# Altium project bidirectionalLevelShifter.PrjPcb
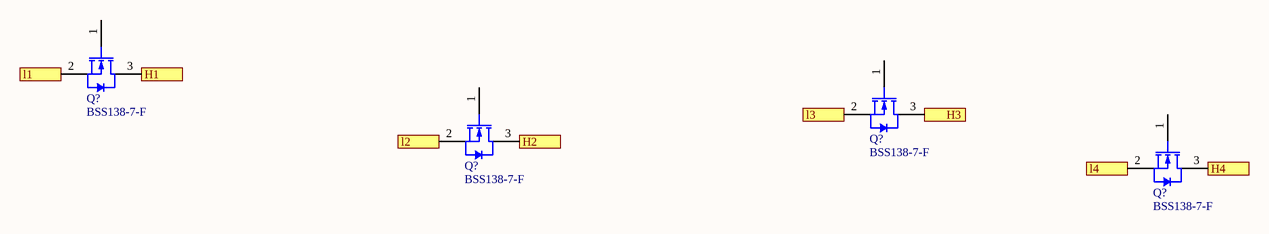
[diagram p0: Sheet2.SchDoc]
1 sheet, 4 parts. Net scope: flat (ports and power ports of the same name join across sheets).

## Sheet Sheet2.SchDoc
size A4

### Parts
(Parts that share a designator on the sheet are numbered #1, #2 ... from top to bottom, then left to right.)
Q?#1  BSS138-7-F  [DIOD-SOT23-3_V]
Q?#2  BSS138-7-F  [DIOD-SOT23-3_V]
Q?#3  BSS138-7-F  [DIOD-SOT23-3_V]
Q?#4  BSS138-7-F  [DIOD-SOT23-3_V]

### Ports
H1, H2, H3, H4, l1, l2, l3, l4

### Nets
NetQ?#1_2: Q?#1.2(S) ; port l1
NetQ?#1_3: Q?#1.3(D) ; port H1
NetQ?#2_2: Q?#2.2(S) ; port l3
NetQ?#2_3: Q?#2.3(D) ; port H3
NetQ?#3_2: Q?#3.2(S) ; port l2
NetQ?#3_3: Q?#3.3(D) ; port H2
NetQ?#4_2: Q?#4.2(S) ; port l4
NetQ?#4_3: Q?#4.3(D) ; port H4

Not connected (* = marked no-connect by the designer): Q?#1 1(G); Q?#2 1(G); Q?#3 1(G); Q?#4 1(G)

### Library data of the parts
Q?#1-Q?#4 = CMP-2000-04930-1: N-Channel Enhancement Mode Mosfet, 50 V, 0.2 A, -55 to 150 degC, 3-Pin SOT23, RoHS, Tape and Reel; Manufacturer: Diodes Inc; Brand: DiodesIncorporated; Unit Weight: 0.000282oz; Pd - Power Dissipation: 300mW; Id - Continuous Drain Current: 200mA; Rds On - Drain-Source Resistance: 3.5Ohms; Vgs - Gate-Source Voltage: 20V; Number of Channels: 1Channel; Vds - Drain-Source Breakdown Voltage: 50V; Transistor Type: 1N-Channel; Typical Turn-Off Delay Time: 20ns; Configuration: Single; Mounting Style: SMD/SMT; Height: 1mm; Package Description: 3-Pin Small Outline Transistor, Body 2.9 x 1.3 mm, Pitch 0.96 mm; Datasheet Version: Rev. 20-2, 11/2013; Minimum Operating Temperature: -55C; Package / Case: SOT-23-3; Channel Mode: Enhancement; Product: MOSFETSmallSignal; Packaging: Reel; Maximum Operating Temperature: +150C; Datasheet URL: https://datasheet.ciiva.com/8115/ds30144-8115344.pdf; Product Category: MOSFET; Width: 1.3mm; Technology: Si; Package Reference: SOT23-3; Manufacturer URL: http://www.diodes.com/; Transistor Polarity: N-Channel; Length: 2.9mm; Factory Pack Quantity: 3000; Series: BSS138; RoHS: True; Typical Turn-On Delay Time: 20ns